# Altium schematic sheet GPRS.SchDoc: GPRS
size A4; DrawnBy: Muhammet YILDIZ; Organization: YıLDıZ IoT; Revision: 1.1; SheetNumber: 4; SheetTotal: 7; SheetSize: A4
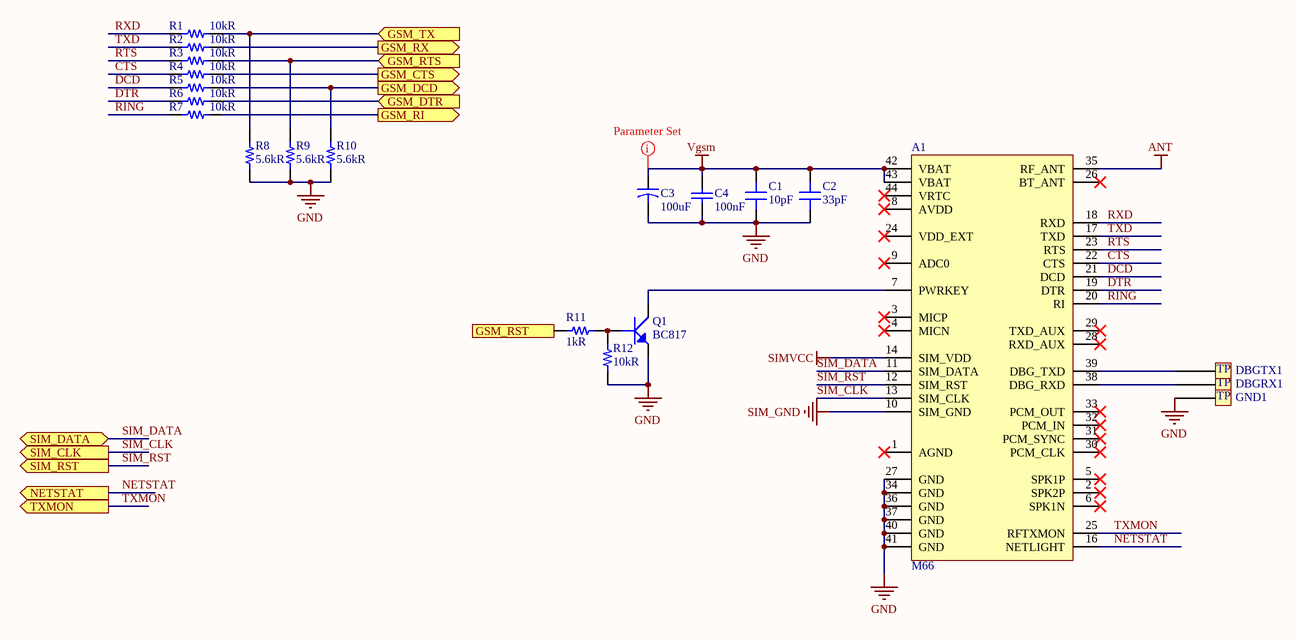
[diagram p0: GPRS.SchDoc]

## Parts
A1  M66  [QUECTEL - M66]
C1  10pF  [CAP 0603/1608]
C2  33pF  [CAP 0603/1608]
C3  100uF  [CAP POL 2012X150USR]
C4  100nF  [CAP 0603/1608]
DBGRX1  Test Point  [TestPoint]  (value not drawn)  (no BOM)
DBGTX1  Test Point  [TestPoint]  (value not drawn)  (no BOM)
GND1  Test Point  [TestPoint]  (value not drawn)  (no BOM)
Q1  BC817  [SOT23-3]
R1  10kR  [RES 0603/1608]
R2  10kR  [RES 0603/1608]
R3  10kR  [RES 0603/1608]
R4  10kR  [RES 0603/1608]
R5  10kR  [RES 0603/1608]
R6  10kR  [RES 0603/1608]
R7  10kR  [RES 0603/1608]
R8  5.6kR  [RES 0603/1608]
R9  5.6kR  [RES 0603/1608]
R10  5.6kR  [RES 0603/1608]
R11  1kR  [RES 0603/1608]
R12  10kR  [RES 0603/1608]

## Ports
GSM_CTS (out), GSM_DCD (out), GSM_DTR (in), GSM_RI (out), GSM_RST (in), GSM_RTS (in), GSM_RX (out), GSM_TX (in), NETSTAT (out), SIM_CLK (out), SIM_DATA (bidir), SIM_RST (out), TXMON (out)

## Nets
ANT: A1.35(RF_ANT)
GND: A1.27(GND) A1.34(GND) A1.36(GND) A1.37(GND) A1.40(GND) A1.41(GND) C1.1 C2.1 C3.1 C4.1 GND1.1 Q1.2(E) R8.1 R9.1 R10.1 R12.1
SIM_GND: A1.10(SIM_GND)
SIMVCC: A1.14(SIM_VDD)
Vgsm: A1.42(VBAT) A1.43(VBAT) C1.2 C2.2 C3.2 C4.2
CTS: A1.22(CTS) R4.2
DCD: A1.21(DCD) R5.2
DTR: A1.19(DTR) R6.2
GSM_CTS: R4.1 ; port GSM_CTS
GSM_DCD: R5.1 R10.2 ; port GSM_DCD
GSM_DTR: R6.1 ; port GSM_DTR
GSM_RI: R7.1 ; port GSM_RI
GSM_RST: R11.2 ; port GSM_RST
GSM_RTS: R3.1 R9.2 ; port GSM_RTS
GSM_RX: R2.1 ; port GSM_RX
GSM_TX: R1.1 R8.2 ; port GSM_TX
NETSTAT: A1.16(NETLIGHT) ; port NETSTAT
RING: A1.20(RI) R7.2
RTS: A1.23(RTS) R3.2
RXD: A1.18(RXD) R1.2
SIM_CLK: A1.13(SIM_CLK) ; port SIM_CLK
SIM_DATA: A1.11(SIM_DATA) ; port SIM_DATA
SIM_RST: A1.12(SIM_RST) ; port SIM_RST
TXD: A1.17(TXD) R2.2
TXMON: A1.25(RFTXMON) ; port TXMON
NetA1_7: A1.7(PWRKEY) Q1.3(C)
NetA1_38: A1.38(DBG_RXD) DBGRX1.1
NetA1_39: A1.39(DBG_TXD) DBGTX1.1
NetQ1_1: Q1.1(B) R11.1 R12.2

Not connected (* = marked no-connect by the designer): A1 1(AGND)* 2(SPK2P)* 3(MICP)* 4(MICN)* 5(SPK1P)* 6(SPK1N)* 8(AVDD)* 9(ADC0)* 15(NC) 24(VDD_EXT)* 26(BT_ANT)* 28(RXD_AUX)* 29(TXD_AUX)* 30(PCM_CLK)* 31(PCM_SYNC)* 32(PCM_IN)* 33(PCM_OUT)* 44(VRTC)*

## Layout directives
rule Width Constraint [Pref Width = 0.5mm    Min Width = 0.5mm    Max Width = 3mm]; net class Vgsm: Vgsm

## Notes on the sheet
- Title:
- Size:
- Project:
- Revision:
- Sheet
- of
- Date:
- YıLDıZ IoT
- Elperek Mahallesi
- Saray Sokak, No:12
- SAKARYA / TURKEY
- File:
- (in symbol Test Point) TP

## Library data of the parts
A1 = Qectel M66: GSM/GPRS Module Series; Manufacturer: QUECTEL; RF Family/Standard: Cellular, Navigation; Protocol: 2G GPRS, GSM; Frequency: 824MHz ~ 960MHz, 1.71GHz ~ 1.99GHz; Data Rate: 85.6kbps; Power - Output: 32.2dBm; Sensitivity: -109dBm; Serial Interfaces: UART; Antenna Type: Antenna Not Included; Voltage - Supply: 3.8V; Current - Receiving: 350mA; Manufacturer Part Number: M66; Supplier 1: empa; Supplier Part Number 1: M66DSFA-04-STD; Stock 1: 1144; Pricing 1: 1 = 6,27 (USD); RoHS: No; Case/Package: Module; ComponentLink1URL: https://www.u-blox.com/sites/default/files/SARA-G3_DataSheet_%28UBX-13000993%29.pdf?src-supplier=Digi-Key; ComponentLink1Description: https://www.u-blox.com/sites/default/files/SARA-G3_DataSheet_%28UBX-13000993%29.pdf?src-supplier=Digi-Key; Current - Transmitting: 350mA; Operating Temperature: 40°C ~ 85°C
C1 = Capacitor - Ceramic: Ceramic, SMT Capacitor; Manufacturer: Yageo; Manufacturer Part Number: CC0603JRNPO9BN100; Tolerance: 5%; Voltage Rating: 50V; Dielectric: C0G; Temperature Coefficient: 30ppm/°C; Insulation Resistance: 100GR; Supplier 1: Digi-Key; Supplier Part Number 1: 311-1058-1-ND; Stock 1: 128799; Pricing 1: 1 = 0,10000, 10 = 0,06100, 100 = 0,02730, 500 = 0,01948, 1000 = 0,01530 (USD); RoHS: Yes; Mount: Surface Mount; Case/Package: 0603; Number of Pins: 2; Case Code (Metric): 1608; Case Code (Imperial): 0603; Min Operating Temperature: -55°C; Max Operating Temperature: 125°C; Capacitance: 10pF; Voltage Rating (DC): 50V; Packaging: Tape and Reel; Package Quantity: 1; Termination: SMD/SMT; Composition: Ceramic; Voltage: 50V; Length: 1.6mm; Height: 0.8mm; Width: 0.031inch; Thickness: 0.035inch; Depth: 0.8mm; Radiation Hardening: No; REACH SVHC: No SVHC; Lead Free: Lead Free; ComponentLink1URL: http://www.farnell.com/datasheets/2213336.pdf?src-supplier=Farnell; ComponentLink1Description: http://www.farnell.com/datasheets/2213336.pdf?src-supplier=Farnell; ComponentLink2URL: https://www.verical.com/server-webapp/html/getDatasheet?partID=403524&src-supplier=Verical; ComponentLink2Description: https://www.verical.com/server-webapp/html/getDatasheet?partID=403524&src-supplier=Verical; ComponentLink3URL: http://www.farnell.com/datasheets/1835847.pdf?src-supplier=Element14; ComponentLink3Description: http://www.farnell.com/datasheets/1835847.pdf?src-supplier=Element14; ComponentLink4URL: http://www.yageo.com/documents/recent/UPY-GP_NP0_16V-to-50V_16.pdf?src-supplier=Digi-Key; ComponentLink4Description: http://www.yageo.com/documents/recent/UPY-GP_NP0_16V-to-50V_16.pdf?src-supplier=Digi-Key; ComponentLink5URL: http://www.farnell.com/datasheets/1734582.pdf?src-supplier=Element14; ComponentLink5Description: http://www.farnell.com/datasheets/1734582.pdf?src-supplier=Element14; ComponentLink6URL: http://www.yageo.com/documents/recent/UPY-GP_NP0_16V-to-50V_8.pdf?src-supplier=Avnet+Europe; ComponentLink6Description: http://www.yageo.com/documents/recent/UPY-GP_NP0_16V-to-50V_8.pdf?src-supplier=Avnet+Europe; ComponentLink7URL: http://www.mouser.com/ds/2/447/Yageo_UPY-GP_NP0_16V-to-50V_9-358835.pdf?src-supplier=Mouser; ComponentLink7Description: http://www.mouser.com/ds/2/447/Yageo_UPY-GP_NP0_16V-to-50V_9-358835.pdf?src-supplier=Mouser; ComponentLink8URL: http://www.farnell.com/datasheets/1132289.pdf?src-supplier=Element14; ComponentLink8Description: http://www.farnell.com/datasheets/1132289.pdf?src-supplier=Element14
C2 = Capacitor - Ceramic: Ceramic, SMT Capacitor; Manufacturer: Walsin Technologies; Manufacturer Part Number: 0603N330J500CT; Tolerance: 5%; Dielectric: C0G; Voltage Rating: 50V; Supplier 1: Digi-Key; Supplier Part Number 1: 1292-1645-1-ND; Stock 1: 411190; Pricing 1: 1 = 0,10000, 10 = 0,03300, 100 = 0,01490, 500 = 0,01062, 1000 = 0,00835 (USD); RoHS: Yes; Case/Package: Ceramic; Case Code (Metric): 1608; Case Code (Imperial): 0603; Min Operating Temperature: -55°C; Max Operating Temperature: 125°C; Capacitance: 33pF; Packaging: Tape and Reel; Voltage Rating (DC): 50V; Length: 1.6mm; Depth: 0.8mm; Radiation Hardening: No; REACH SVHC: Unknown; Lead Free: Lead Free; ComponentLink1URL: https://www.verical.com/server-webapp/html/getDatasheet?partID=572322&src-supplier=Verical; ComponentLink1Description: https://www.verical.com/server-webapp/html/getDatasheet?partID=572322&src-supplier=Verical
C3 = Capacitor - Tantalum: Capacitor, Tantalum; Manufacturer: Kyocera AVX; Manufacturer Part Number: TPSB107M006R0250; ESR (Equivalent Series Resistance): 250mR; Voltage Rating: 6.3V; Tolerance: 20%; Polarity: Polar; Dissipation Factor: 10%; Supplier 1: Digi-Key; Supplier Part Number 1: 478-4978-1-ND; Stock 1: 22431; Pricing 1: 1 = 0,65000, 10 = 0,47900, 100 = 0,32840, 500 = 0,25996, 1000 = 0,21891 (USD); RoHS: Yes; Mount: Surface Mount; Case/Package: 1210; Number of Pins: 2; Case Code (Imperial): 1210; Case Code (Metric): 3528; Dielectric Material: Tantalum; Min Operating Temperature: -55°C; Max Operating Temperature: 125°C; Capacitance: 100uF; Package Quantity: 1; Packaging: Tape and Reel; Termination: SMD/SMT; Voltage Rating (DC): 6.3V; Features: General Purpose; Length: 3.5mm; Height: 2.1mm; Width: 2.8mm; Height - Seated (Max): 0.083inch; Depth: 2.8mm; Radiation Hardening: No; Lead Free: Lead Free; ComponentLink1URL: http://datasheets.avx.com/TPS.pdf?src-supplier=Digi-Key; ComponentLink1Description: http://datasheets.avx.com/TPS.pdf?src-supplier=Digi-Key; ComponentLink2URL: http://www.avx.com/docs/catalogs/tps.pdf?src-supplier=Avnet; ComponentLink2Description: http://www.avx.com/docs/catalogs/tps.pdf?src-supplier=Avnet; ComponentLink3URL: http://www.avxcorp.com/docs/Catalogs/tps.pdf?src-supplier=Future+Electronics; ComponentLink3Description: http://www.avxcorp.com/docs/Catalogs/tps.pdf?src-supplier=Future+Electronics; ComponentLink4URL: http://www.avx.com/docs/catalogs/tps.pdf?src-supplier=Avnet+Europe; ComponentLink4Description: http://www.avx.com/docs/catalogs/tps.pdf?src-supplier=Avnet+Europe
C4 = Cap - Ceramic: Capacitor, Ceramic; Manufacturer: Samsung; Manufacturer Part Number: CL10A104KA8NNNC; Tolerance: 10%; Voltage Rating: 25V; Dielectric: X5R; Supplier 1: Digi-Key; Supplier Part Number 1: 1276-1857-1-ND; Stock 1: 978306; Pricing 1: 1 = 0,10000, 10 = 0,04600, 100 = 0,02070, 500 = 0,01478, 1000 = 0,01162 (USD); RoHS: Yes; Mount: Surface Mount; Case/Package: 0603; Case Code (Metric): 1608; Case Code (Imperial): 0603; Contact Plating: Tin; Min Operating Temperature: -55°C; Max Operating Temperature: 85°C; Package Quantity: 1; Packaging: Tape and Reel; Capacitance: 100nF; Voltage Rating (DC): 25V; Termination: Wraparound; Length: 0.063inch; Width: 0.031inch; Thickness: 0.035inch; Lead Free: Lead Free; ComponentLink1URL: http://www.samsungsem.com/kr/support/library/product-catalog/mlcc.jsp; ComponentLink1Description: http://www.samsungsem.com/kr/support/library/product-catalog/mlcc.jsp; Price: 0,1
DBGRX1 DBGTX1 GND1 = Test Point: Custom Test Point
Q1 = BC817: Transistor, BC817; Manufacturer: ON Semiconductor; Manufacturer Part Number: BC817-16LT1G; Transistor Type: NPN; Vce Saturation (Max) @ Ib, Ic: 700mV @ 50mA, 500mA; Current - Collector Cutoff (Max): 100nA (ICBO); DC Current Gain (hFE) (Min) @ Ic, Vce: 100 @ 100mA, 1V; Frequency - Transition: 100MHz; Supplier 1: Digi-Key; Supplier Part Number 1: BC817-16LT1GOSCT-ND; RoHS: RoHS Compliant; Category: Discrete Semiconductor Products; Stock 1: 46603; Pricing 1: 1=0.13, 10=0.118, 100=0.0642, 500=0.0395, 1000=0.02693 (USD); Packaging: Cut Tape (CT); Part Status: Active; Operating Temperature: -65°C ~ 150°C (TJ); Mounting Type: Surface Mount; Package / Case: TO-236-3, SC-59, SOT-23-3; Supplier Device Package: SOT-23-3 (TO-236); Base Part Number: BC817; ComponentLink1URL: http://www.onsemi.com/pub/Collateral/BC817-16LT1-D.PDF; ComponentLink1Description: http://www.onsemi.com/pub/Collateral/BC817-16LT1-D.PDF; Price: 0,13
R1-R7 R12 = Resistor_Chip: Ceramic, SMT Capacitor; Manufacturer: Stackpole Electronics; Manufacturer Part Number: RNCP0603FTD10K0; Tolerance: 1%; Max Power Dissipation: 125mW; Temperature Coefficient: 100ppm/°C; Supplier 1: Digi-Key; Supplier Part Number 1: RNCP0603FTD10K0CT-ND; Stock 1: 183083; Pricing 1: 1 = 0,10000, 10 = 0,06700, 100 = 0,02730, 1000 = 0,01224, 2500 = 0,01063 (USD); RoHS: Yes; Mount: Surface Mount; Case/Package: 0603; Case Code (Metric): 1608; Case Code (Imperial): 0603; Contact Plating: Matte,Tin; Min Operating Temperature: -55°C; Max Operating Temperature: 155°C; Packaging: Tape and Reel; Resistance: 10kR; Composition: Thin Film; Number of Terminations: 2; Features: Anti-Sulfur,Moisture Resistant; Length: 0.059inch; Height: 0.02inch; Width: 0.031inch; Radiation Hardening: No; Lead Free: Lead Free
R8-R10 = Resistor_Chip: Ceramic, SMT Capacitor; Manufacturer: TE Connectivity; Manufacturer Part Number: CRGCQ0603F5K6; Tolerance: 1%; Max Power Dissipation: 100mW; Temperature Coefficient: 100ppm/°C; Supplier 1: Digi-Key; Supplier Part Number 1: A129697CT-ND; Stock 1: 37798; Pricing 1: 1 = 0,10000, 10 = 0,03000, 100 = 0,01200, 1000 = 0,00541, 2500 = 0,00469 (USD); RoHS: No; Case/Package: 0603; Case Code (Imperial): 0603; Case Code (Metric): 1608; Min Operating Temperature: -55°C; Max Operating Temperature: 155°C; Composition: Thick Film; Features: Moisture Resistant,Automotive AEC-Q200; Packaging: Cut Tape; Resistance: 5.6kR; Number of Terminations: 2; ComponentLink1URL: http://www.farnell.com/datasheets/2609223.pdf?src-supplier=Farnell; ComponentLink1Description: http://www.farnell.com/datasheets/2609223.pdf?src-supplier=Farnell; ComponentLink2URL: https://www.te.com/commerce/DocumentDelivery/DDEController?Action=srchrtrv&amp;DocNm=1773204-3&amp;DocType=DS&amp;DocLang=English&src-supplier=Digi-Key; ComponentLink2Description: https://www.te.com/commerce/DocumentDelivery/DDEController?Action=srchrtrv&amp;DocNm=1773204-3&amp;DocType=DS&amp;DocLang=English&src-supplier=Digi-Key; ComponentLink3URL: https://www.te.com/commerce/DocumentDelivery/DDEController?Action=srchrtrv&DocNm=1773204-3&DocType=DS&DocLang=English&src-supplier=Digi-Key; ComponentLink3Description: https://www.te.com/commerce/DocumentDelivery/DDEController?Action=srchrtrv&DocNm=1773204-3&DocType=DS&DocLang=English&src-supplier=Digi-Key
R11 = Resistor_Chip: Ceramic, SMT Capacitor; Manufacturer: Rohm; Manufacturer Part Number: ESR03EZPJ102; Tolerance: 5%; Temperature Coefficient: 200ppm/°C; Max Power Dissipation: 250mW; Supplier 1: Digi-Key; Supplier Part Number 1: RHM1.0KDCT-ND; Stock 1: 148117; Pricing 1: 1 = 0,10000, 10 = 0,08300, 100 = 0,03180, 1000 = 0,01398, 2500 = 0,01207 (USD); RoHS: Yes; Case/Package: 0603; Case Code (Metric): 1608; Case Code (Imperial): 0603; Min Operating Temperature: -55°C; Max Operating Temperature: 155°C; Resistance: 1kR; Package Quantity: 1; Packaging: Tape and Reel; Composition: Thick Film; Number of Terminations: 2; Features: Automotive AEC-Q200; Length: 0.063inch; Height: 0.022inch; Width: 0.031inch; Lead Free: Lead Free; ComponentLink1URL: https://datasheet.ciiva.com/2469/esr-2469603.pdf?src-supplier=Digi-Key; ComponentLink1Description: https://datasheet.ciiva.com/2469/esr-2469603.pdf?src-supplier=Digi-Key; ComponentLink2URL: https://datasheet.ciiva.com/2469/esr-2469604.pdf?src-supplier=Digi-Key; ComponentLink2Description: https://datasheet.ciiva.com/2469/esr-2469604.pdf?src-supplier=Digi-Key; ComponentLink3URL: https://datasheet.ciiva.com/2469/esr-2469605.pdf?src-supplier=Digi-Key; ComponentLink3Description: https://datasheet.ciiva.com/2469/esr-2469605.pdf?src-supplier=Digi-Key